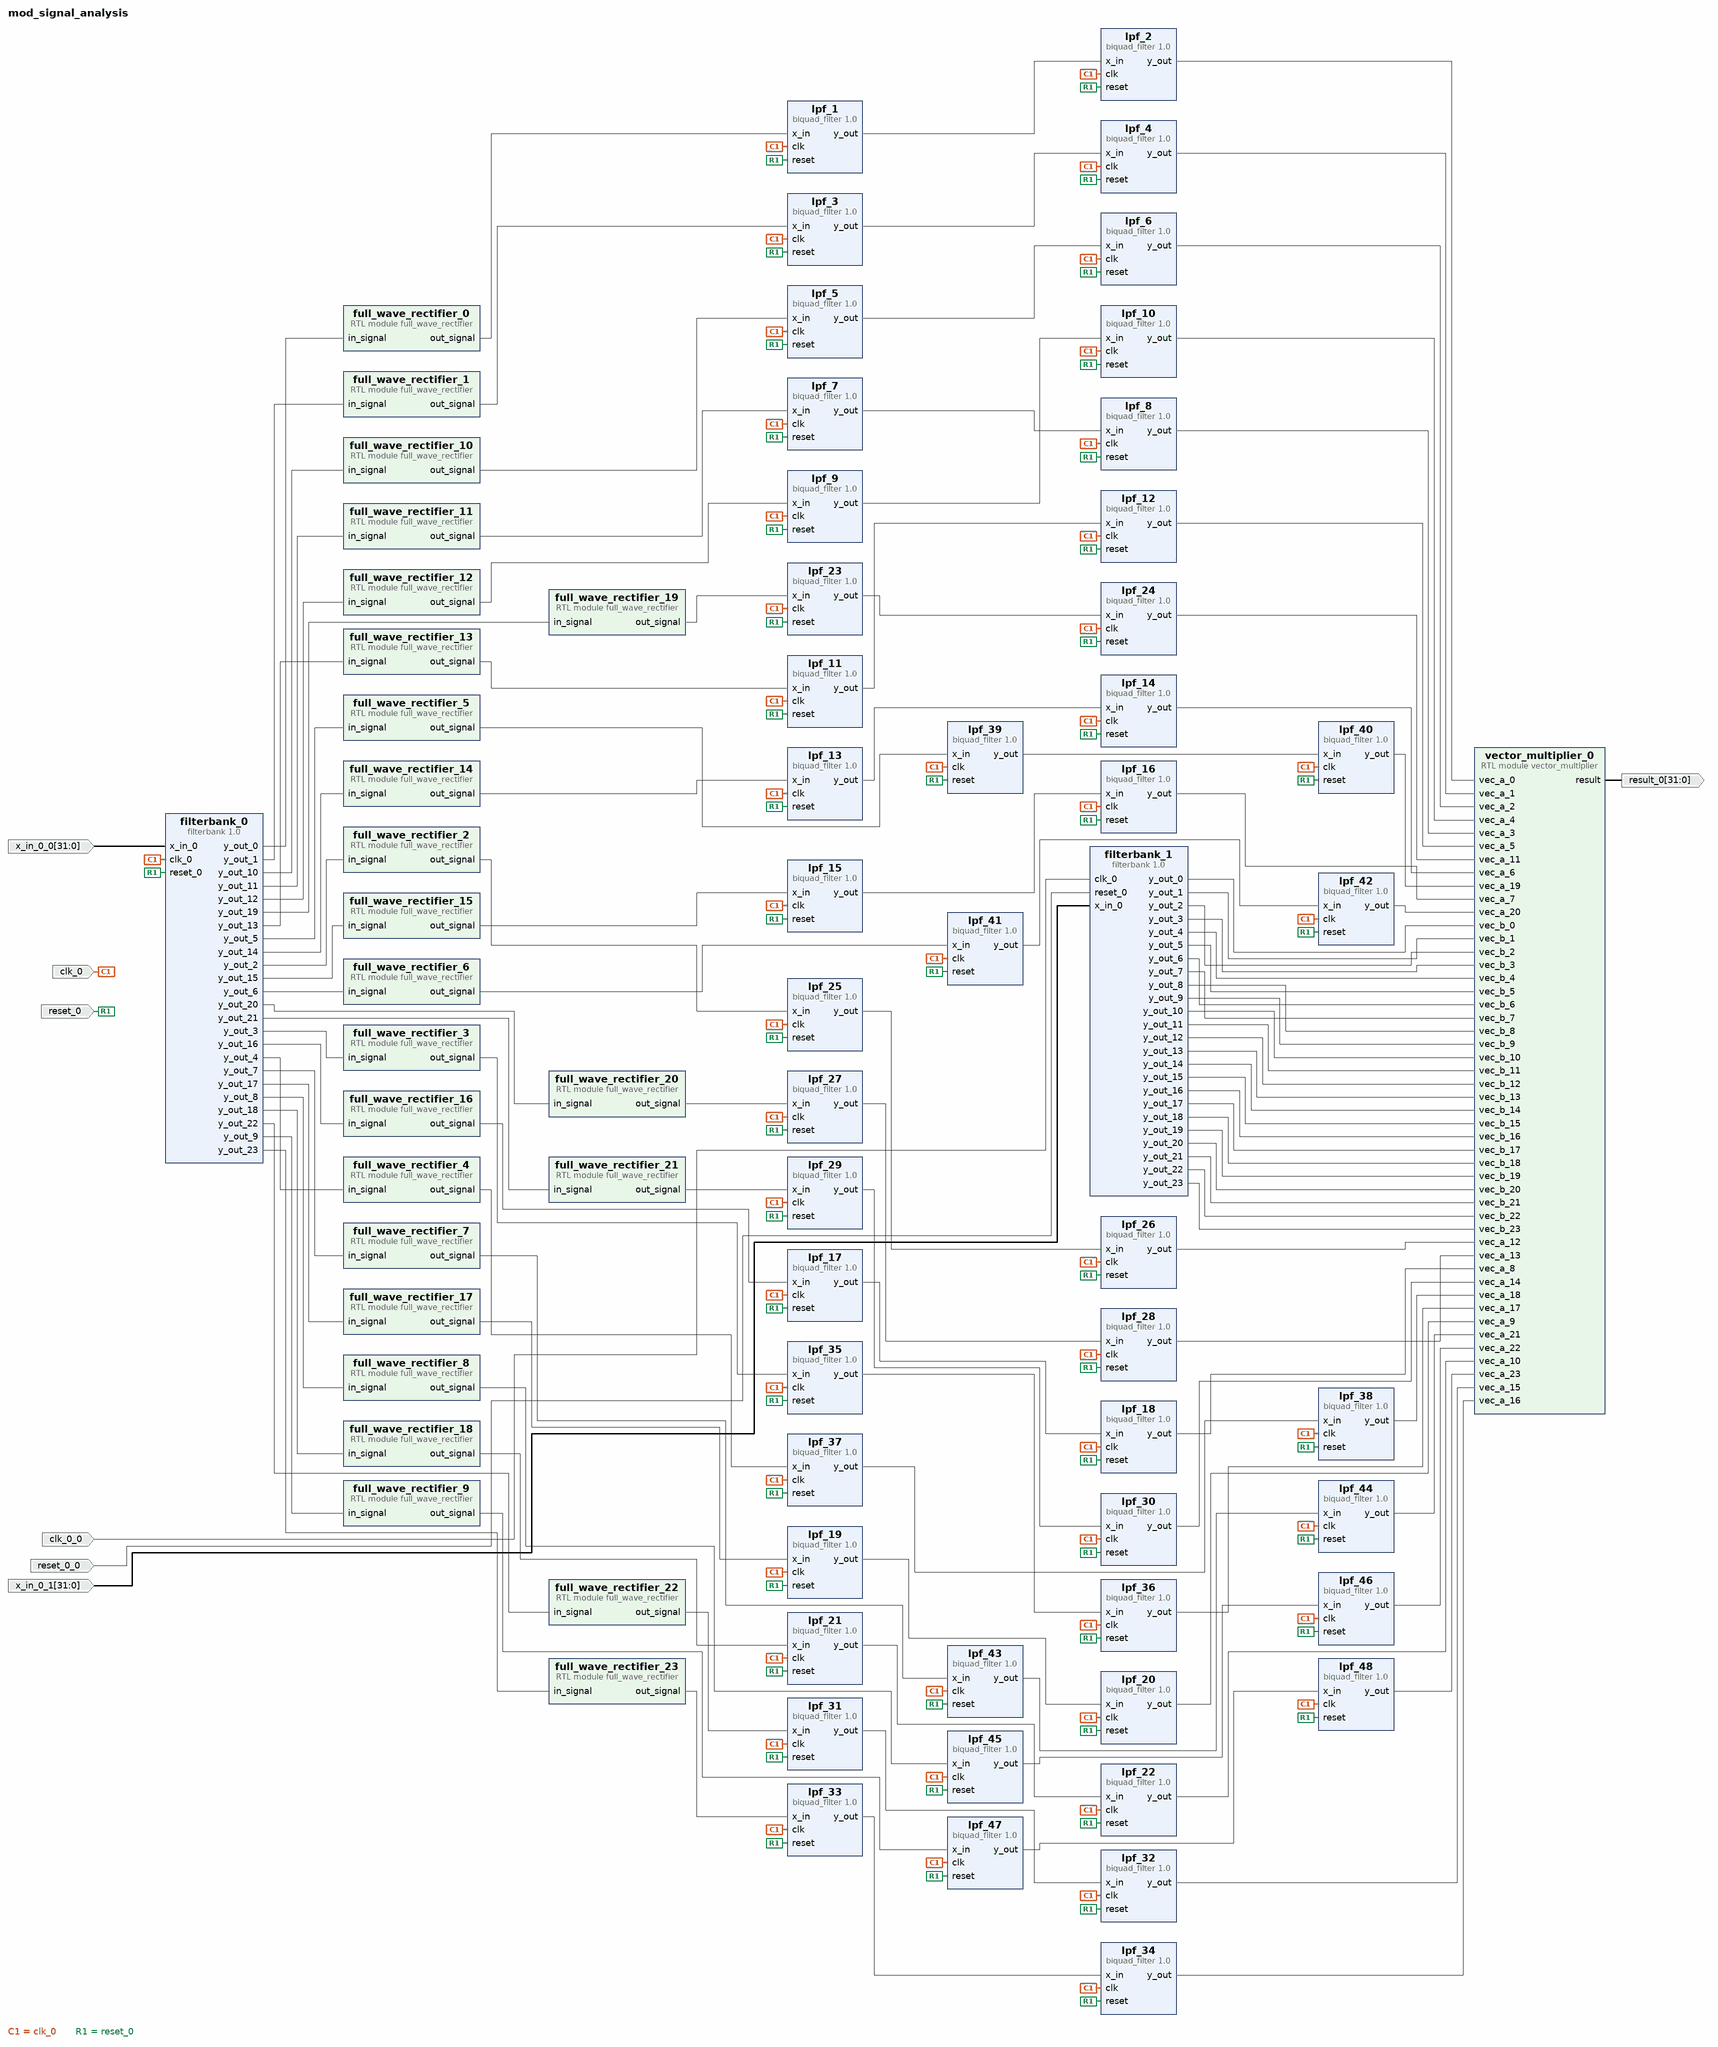
[diagram p0: block diagram of the top level]
# Vivado block design mod_signal_analysis, xc7a200tsbg484-1, Vivado 2023.2
create_bd_design mod_signal_analysis

create_bd_port -dir I -type clk clk_0
set_property -dict {CONFIG.CLK_DOMAIN filterbank_test_sim_clk_gen_1_0_clk CONFIG.FREQ_HZ 48000} [get_bd_ports clk_0]
create_bd_port -dir I -type rst reset_0
set_property -dict {CONFIG.POLARITY ACTIVE_HIGH} [get_bd_ports reset_0]
create_bd_port -dir I -from 31 -to 0 x_in_0_0
create_bd_port -dir I -type clk clk_0_0
set_property -dict {CONFIG.FREQ_HZ 48000} [get_bd_ports clk_0_0]
create_bd_port -dir I -type rst reset_0_0
set_property -dict {CONFIG.POLARITY ACTIVE_HIGH} [get_bd_ports reset_0_0]
create_bd_port -dir I -from 31 -to 0 x_in_0_1
create_bd_port -dir O -from 31 -to 0 result_0

create_bd_cell -type module -reference full_wave_rectifier full_wave_rectifier_0
create_bd_cell -type module -reference full_wave_rectifier full_wave_rectifier_1
create_bd_cell -type module -reference full_wave_rectifier full_wave_rectifier_2
create_bd_cell -type module -reference full_wave_rectifier full_wave_rectifier_3
create_bd_cell -type module -reference full_wave_rectifier full_wave_rectifier_4
create_bd_cell -type module -reference full_wave_rectifier full_wave_rectifier_5
create_bd_cell -type module -reference full_wave_rectifier full_wave_rectifier_6
create_bd_cell -type module -reference full_wave_rectifier full_wave_rectifier_7
create_bd_cell -type module -reference full_wave_rectifier full_wave_rectifier_8
create_bd_cell -type module -reference full_wave_rectifier full_wave_rectifier_9
create_bd_cell -type module -reference full_wave_rectifier full_wave_rectifier_10
create_bd_cell -type module -reference full_wave_rectifier full_wave_rectifier_11
create_bd_cell -type module -reference full_wave_rectifier full_wave_rectifier_12
create_bd_cell -type module -reference full_wave_rectifier full_wave_rectifier_13
create_bd_cell -type module -reference full_wave_rectifier full_wave_rectifier_14
create_bd_cell -type module -reference full_wave_rectifier full_wave_rectifier_15
create_bd_cell -type module -reference full_wave_rectifier full_wave_rectifier_16
create_bd_cell -type module -reference full_wave_rectifier full_wave_rectifier_17
create_bd_cell -type module -reference full_wave_rectifier full_wave_rectifier_18
create_bd_cell -type module -reference full_wave_rectifier full_wave_rectifier_19
create_bd_cell -type module -reference full_wave_rectifier full_wave_rectifier_20
create_bd_cell -type module -reference full_wave_rectifier full_wave_rectifier_21
create_bd_cell -type module -reference full_wave_rectifier full_wave_rectifier_22
create_bd_cell -type module -reference full_wave_rectifier full_wave_rectifier_23
create_bd_cell -type module -reference vector_multiplier vector_multiplier_0
create_bd_cell -type ip -vlnv xilinx.com:user:filterbank:1.0 filterbank_0
create_bd_cell -type ip -vlnv xilinx.com:user:filterbank:1.0 filterbank_1
create_bd_cell -type ip -vlnv xilinx.com:user:biquad_filter:1.0 lpf_1
set_property -dict {CONFIG.a1 0x80A6 CONFIG.a2 0x3F5D CONFIG.b0 0x0001 CONFIG.b1 0x0001 CONFIG.b2 0x0001} [get_bd_cells lpf_1]
create_bd_cell -type ip -vlnv xilinx.com:user:biquad_filter:1.0 lpf_2
set_property -dict {CONFIG.a1 0x818A CONFIG.a2 0x3E78 CONFIG.b0 0x0001 CONFIG.b1 0x0001 CONFIG.b2 0x0001} [get_bd_cells lpf_2]
create_bd_cell -type ip -vlnv xilinx.com:user:biquad_filter:1.0 lpf_19
set_property -dict {CONFIG.a1 0x80A6 CONFIG.a2 0x3F5D CONFIG.b0 0x0001 CONFIG.b1 0x0001 CONFIG.b2 0x0001} [get_bd_cells lpf_19]
create_bd_cell -type ip -vlnv xilinx.com:user:biquad_filter:1.0 lpf_21
set_property -dict {CONFIG.a1 0x80A6 CONFIG.a2 0x3F5D CONFIG.b0 0x0001 CONFIG.b1 0x0001 CONFIG.b2 0x0001} [get_bd_cells lpf_21]
create_bd_cell -type ip -vlnv xilinx.com:user:biquad_filter:1.0 lpf_23
set_property -dict {CONFIG.a1 0x80A6 CONFIG.a2 0x3F5D CONFIG.b0 0x0001 CONFIG.b1 0x0001 CONFIG.b2 0x0001} [get_bd_cells lpf_23]
create_bd_cell -type ip -vlnv xilinx.com:user:biquad_filter:1.0 lpf_25
set_property -dict {CONFIG.a1 0x80A6 CONFIG.a2 0x3F5D CONFIG.b0 0x0001 CONFIG.b1 0x0001 CONFIG.b2 0x0001} [get_bd_cells lpf_25]
create_bd_cell -type ip -vlnv xilinx.com:user:biquad_filter:1.0 lpf_27
set_property -dict {CONFIG.a1 0x80A6 CONFIG.a2 0x3F5D CONFIG.b0 0x0001 CONFIG.b1 0x0001 CONFIG.b2 0x0001} [get_bd_cells lpf_27]
create_bd_cell -type ip -vlnv xilinx.com:user:biquad_filter:1.0 lpf_29
set_property -dict {CONFIG.a1 0x80A6 CONFIG.a2 0x3F5D CONFIG.b0 0x0001 CONFIG.b1 0x0001 CONFIG.b2 0x0001} [get_bd_cells lpf_29]
create_bd_cell -type ip -vlnv xilinx.com:user:biquad_filter:1.0 lpf_31
set_property -dict {CONFIG.a1 0x80A6 CONFIG.a2 0x3F5D CONFIG.b0 0x0001 CONFIG.b1 0x0001 CONFIG.b2 0x0001} [get_bd_cells lpf_31]
create_bd_cell -type ip -vlnv xilinx.com:user:biquad_filter:1.0 lpf_33
set_property -dict {CONFIG.a1 0x80A6 CONFIG.a2 0x3F5D CONFIG.b0 0x0001 CONFIG.b1 0x0001 CONFIG.b2 0x0001} [get_bd_cells lpf_33]
create_bd_cell -type ip -vlnv xilinx.com:user:biquad_filter:1.0 lpf_35
set_property -dict {CONFIG.a1 0x80A6 CONFIG.a2 0x3F5D CONFIG.b0 0x0001 CONFIG.b1 0x0001 CONFIG.b2 0x0001} [get_bd_cells lpf_35]
create_bd_cell -type ip -vlnv xilinx.com:user:biquad_filter:1.0 lpf_37
set_property -dict {CONFIG.a1 0x80A6 CONFIG.a2 0x3F5D CONFIG.b0 0x0001 CONFIG.b1 0x0001 CONFIG.b2 0x0001} [get_bd_cells lpf_37]
create_bd_cell -type ip -vlnv xilinx.com:user:biquad_filter:1.0 lpf_3
set_property -dict {CONFIG.a1 0x80A6 CONFIG.a2 0x3F5D CONFIG.b0 0x0001 CONFIG.b1 0x0001 CONFIG.b2 0x0001} [get_bd_cells lpf_3]
create_bd_cell -type ip -vlnv xilinx.com:user:biquad_filter:1.0 lpf_39
set_property -dict {CONFIG.a1 0x80A6 CONFIG.a2 0x3F5D CONFIG.b0 0x0001 CONFIG.b1 0x0001 CONFIG.b2 0x0001} [get_bd_cells lpf_39]
create_bd_cell -type ip -vlnv xilinx.com:user:biquad_filter:1.0 lpf_41
set_property -dict {CONFIG.a1 0x80A6 CONFIG.a2 0x3F5D CONFIG.b0 0x0001 CONFIG.b1 0x0001 CONFIG.b2 0x0001} [get_bd_cells lpf_41]
create_bd_cell -type ip -vlnv xilinx.com:user:biquad_filter:1.0 lpf_43
set_property -dict {CONFIG.a1 0x80A6 CONFIG.a2 0x3F5D CONFIG.b0 0x0001 CONFIG.b1 0x0001 CONFIG.b2 0x0001} [get_bd_cells lpf_43]
create_bd_cell -type ip -vlnv xilinx.com:user:biquad_filter:1.0 lpf_45
set_property -dict {CONFIG.a1 0x80A6 CONFIG.a2 0x3F5D CONFIG.b0 0x0001 CONFIG.b1 0x0001 CONFIG.b2 0x0001} [get_bd_cells lpf_45]
create_bd_cell -type ip -vlnv xilinx.com:user:biquad_filter:1.0 lpf_47
set_property -dict {CONFIG.a1 0x80A6 CONFIG.a2 0x3F5D CONFIG.b0 0x0001 CONFIG.b1 0x0001 CONFIG.b2 0x0001} [get_bd_cells lpf_47]
create_bd_cell -type ip -vlnv xilinx.com:user:biquad_filter:1.0 lpf_5
set_property -dict {CONFIG.a1 0x80A6 CONFIG.a2 0x3F5D CONFIG.b0 0x0001 CONFIG.b1 0x0001 CONFIG.b2 0x0001} [get_bd_cells lpf_5]
create_bd_cell -type ip -vlnv xilinx.com:user:biquad_filter:1.0 lpf_7
set_property -dict {CONFIG.a1 0x80A6 CONFIG.a2 0x3F5D CONFIG.b0 0x0001 CONFIG.b1 0x0001 CONFIG.b2 0x0001} [get_bd_cells lpf_7]
create_bd_cell -type ip -vlnv xilinx.com:user:biquad_filter:1.0 lpf_9
set_property -dict {CONFIG.a1 0x80A6 CONFIG.a2 0x3F5D CONFIG.b0 0x0001 CONFIG.b1 0x0001 CONFIG.b2 0x0001} [get_bd_cells lpf_9]
create_bd_cell -type ip -vlnv xilinx.com:user:biquad_filter:1.0 lpf_11
set_property -dict {CONFIG.a1 0x80A6 CONFIG.a2 0x3F5D CONFIG.b0 0x0001 CONFIG.b1 0x0001 CONFIG.b2 0x0001} [get_bd_cells lpf_11]
create_bd_cell -type ip -vlnv xilinx.com:user:biquad_filter:1.0 lpf_13
set_property -dict {CONFIG.a1 0x80A6 CONFIG.a2 0x3F5D CONFIG.b0 0x0001 CONFIG.b1 0x0001 CONFIG.b2 0x0001} [get_bd_cells lpf_13]
create_bd_cell -type ip -vlnv xilinx.com:user:biquad_filter:1.0 lpf_15
set_property -dict {CONFIG.a1 0x80A6 CONFIG.a2 0x3F5D CONFIG.b0 0x0001 CONFIG.b1 0x0001 CONFIG.b2 0x0001} [get_bd_cells lpf_15]
create_bd_cell -type ip -vlnv xilinx.com:user:biquad_filter:1.0 lpf_17
set_property -dict {CONFIG.a1 0x80A6 CONFIG.a2 0x3F5D CONFIG.b0 0x0001 CONFIG.b1 0x0001 CONFIG.b2 0x0001} [get_bd_cells lpf_17]
create_bd_cell -type ip -vlnv xilinx.com:user:biquad_filter:1.0 lpf_4
set_property -dict {CONFIG.a1 0x818A CONFIG.a2 0x3E78 CONFIG.b0 0x0001 CONFIG.b1 0x0001 CONFIG.b2 0x0001} [get_bd_cells lpf_4]
create_bd_cell -type ip -vlnv xilinx.com:user:biquad_filter:1.0 lpf_22
set_property -dict {CONFIG.a1 0x818A CONFIG.a2 0x3E78 CONFIG.b0 0x0001 CONFIG.b1 0x0001 CONFIG.b2 0x0001} [get_bd_cells lpf_22]
create_bd_cell -type ip -vlnv xilinx.com:user:biquad_filter:1.0 lpf_24
set_property -dict {CONFIG.a1 0x818A CONFIG.a2 0x3E78 CONFIG.b0 0x0001 CONFIG.b1 0x0001 CONFIG.b2 0x0001} [get_bd_cells lpf_24]
create_bd_cell -type ip -vlnv xilinx.com:user:biquad_filter:1.0 lpf_26
set_property -dict {CONFIG.a1 0x818A CONFIG.a2 0x3E78 CONFIG.b0 0x0001 CONFIG.b1 0x0001 CONFIG.b2 0x0001} [get_bd_cells lpf_26]
create_bd_cell -type ip -vlnv xilinx.com:user:biquad_filter:1.0 lpf_28
set_property -dict {CONFIG.a1 0x818A CONFIG.a2 0x3E78 CONFIG.b0 0x0001 CONFIG.b1 0x0001 CONFIG.b2 0x0001} [get_bd_cells lpf_28]
create_bd_cell -type ip -vlnv xilinx.com:user:biquad_filter:1.0 lpf_30
set_property -dict {CONFIG.a1 0x818A CONFIG.a2 0x3E78 CONFIG.b0 0x0001 CONFIG.b1 0x0001 CONFIG.b2 0x0001} [get_bd_cells lpf_30]
create_bd_cell -type ip -vlnv xilinx.com:user:biquad_filter:1.0 lpf_32
set_property -dict {CONFIG.a1 0x818A CONFIG.a2 0x3E78 CONFIG.b0 0x0001 CONFIG.b1 0x0001 CONFIG.b2 0x0001} [get_bd_cells lpf_32]
create_bd_cell -type ip -vlnv xilinx.com:user:biquad_filter:1.0 lpf_34
set_property -dict {CONFIG.a1 0x818A CONFIG.a2 0x3E78 CONFIG.b0 0x0001 CONFIG.b1 0x0001 CONFIG.b2 0x0001} [get_bd_cells lpf_34]
create_bd_cell -type ip -vlnv xilinx.com:user:biquad_filter:1.0 lpf_36
set_property -dict {CONFIG.a1 0x818A CONFIG.a2 0x3E78 CONFIG.b0 0x0001 CONFIG.b1 0x0001 CONFIG.b2 0x0001} [get_bd_cells lpf_36]
create_bd_cell -type ip -vlnv xilinx.com:user:biquad_filter:1.0 lpf_38
set_property -dict {CONFIG.a1 0x818A CONFIG.a2 0x3E78 CONFIG.b0 0x0001 CONFIG.b1 0x0001 CONFIG.b2 0x0001} [get_bd_cells lpf_38]
create_bd_cell -type ip -vlnv xilinx.com:user:biquad_filter:1.0 lpf_40
set_property -dict {CONFIG.a1 0x818A CONFIG.a2 0x3E78 CONFIG.b0 0x0001 CONFIG.b1 0x0001 CONFIG.b2 0x0001} [get_bd_cells lpf_40]
create_bd_cell -type ip -vlnv xilinx.com:user:biquad_filter:1.0 lpf_6
set_property -dict {CONFIG.a1 0x818A CONFIG.a2 0x3E78 CONFIG.b0 0x0001 CONFIG.b1 0x0001 CONFIG.b2 0x0001} [get_bd_cells lpf_6]
create_bd_cell -type ip -vlnv xilinx.com:user:biquad_filter:1.0 lpf_42
set_property -dict {CONFIG.a1 0x818A CONFIG.a2 0x3E78 CONFIG.b0 0x0001 CONFIG.b1 0x0001 CONFIG.b2 0x0001} [get_bd_cells lpf_42]
create_bd_cell -type ip -vlnv xilinx.com:user:biquad_filter:1.0 lpf_44
set_property -dict {CONFIG.a1 0x818A CONFIG.a2 0x3E78 CONFIG.b0 0x0001 CONFIG.b1 0x0001 CONFIG.b2 0x0001} [get_bd_cells lpf_44]
create_bd_cell -type ip -vlnv xilinx.com:user:biquad_filter:1.0 lpf_46
set_property -dict {CONFIG.a1 0x818A CONFIG.a2 0x3E78 CONFIG.b0 0x0001 CONFIG.b1 0x0001 CONFIG.b2 0x0001} [get_bd_cells lpf_46]
create_bd_cell -type ip -vlnv xilinx.com:user:biquad_filter:1.0 lpf_48
set_property -dict {CONFIG.a1 0x818A CONFIG.a2 0x3E78 CONFIG.b0 0x0001 CONFIG.b1 0x0001 CONFIG.b2 0x0001} [get_bd_cells lpf_48]
create_bd_cell -type ip -vlnv xilinx.com:user:biquad_filter:1.0 lpf_8
set_property -dict {CONFIG.a1 0x818A CONFIG.a2 0x3E78 CONFIG.b0 0x0001 CONFIG.b1 0x0001 CONFIG.b2 0x0001} [get_bd_cells lpf_8]
create_bd_cell -type ip -vlnv xilinx.com:user:biquad_filter:1.0 lpf_10
set_property -dict {CONFIG.a1 0x818A CONFIG.a2 0x3E78 CONFIG.b0 0x0001 CONFIG.b1 0x0001 CONFIG.b2 0x0001} [get_bd_cells lpf_10]
create_bd_cell -type ip -vlnv xilinx.com:user:biquad_filter:1.0 lpf_12
set_property -dict {CONFIG.a1 0x818A CONFIG.a2 0x3E78 CONFIG.b0 0x0001 CONFIG.b1 0x0001 CONFIG.b2 0x0001} [get_bd_cells lpf_12]
create_bd_cell -type ip -vlnv xilinx.com:user:biquad_filter:1.0 lpf_14
set_property -dict {CONFIG.a1 0x818A CONFIG.a2 0x3E78 CONFIG.b0 0x0001 CONFIG.b1 0x0001 CONFIG.b2 0x0001} [get_bd_cells lpf_14]
create_bd_cell -type ip -vlnv xilinx.com:user:biquad_filter:1.0 lpf_16
set_property -dict {CONFIG.a1 0x818A CONFIG.a2 0x3E78 CONFIG.b0 0x0001 CONFIG.b1 0x0001 CONFIG.b2 0x0001} [get_bd_cells lpf_16]
create_bd_cell -type ip -vlnv xilinx.com:user:biquad_filter:1.0 lpf_18
set_property -dict {CONFIG.a1 0x818A CONFIG.a2 0x3E78 CONFIG.b0 0x0001 CONFIG.b1 0x0001 CONFIG.b2 0x0001} [get_bd_cells lpf_18]
create_bd_cell -type ip -vlnv xilinx.com:user:biquad_filter:1.0 lpf_20
set_property -dict {CONFIG.a1 0x818A CONFIG.a2 0x3E78 CONFIG.b0 0x0001 CONFIG.b1 0x0001 CONFIG.b2 0x0001} [get_bd_cells lpf_20]

# ---- connections ----

connect_bd_net -net clk_0_0_1 [get_bd_ports clk_0_0] [get_bd_pins filterbank_1/clk_0]
connect_bd_net [get_bd_pins filterbank_0/y_out_0] [get_bd_pins full_wave_rectifier_0/in_signal]
connect_bd_net [get_bd_pins filterbank_0/y_out_1] [get_bd_pins full_wave_rectifier_1/in_signal]
connect_bd_net [get_bd_pins filterbank_0/y_out_2] [get_bd_pins full_wave_rectifier_2/in_signal]
connect_bd_net [get_bd_pins filterbank_0/y_out_3] [get_bd_pins full_wave_rectifier_3/in_signal]
connect_bd_net [get_bd_pins filterbank_0/y_out_4] [get_bd_pins full_wave_rectifier_4/in_signal]
connect_bd_net [get_bd_pins filterbank_0/y_out_5] [get_bd_pins full_wave_rectifier_5/in_signal]
connect_bd_net [get_bd_pins filterbank_0/y_out_6] [get_bd_pins full_wave_rectifier_6/in_signal]
connect_bd_net [get_bd_pins filterbank_0/y_out_7] [get_bd_pins full_wave_rectifier_7/in_signal]
connect_bd_net [get_bd_pins filterbank_0/y_out_8] [get_bd_pins full_wave_rectifier_8/in_signal]
connect_bd_net [get_bd_pins filterbank_0/y_out_9] [get_bd_pins full_wave_rectifier_9/in_signal]
connect_bd_net [get_bd_pins filterbank_0/y_out_10] [get_bd_pins full_wave_rectifier_10/in_signal]
connect_bd_net [get_bd_pins filterbank_0/y_out_11] [get_bd_pins full_wave_rectifier_11/in_signal]
connect_bd_net [get_bd_pins filterbank_0/y_out_12] [get_bd_pins full_wave_rectifier_12/in_signal]
connect_bd_net [get_bd_pins filterbank_0/y_out_13] [get_bd_pins full_wave_rectifier_13/in_signal]
connect_bd_net [get_bd_pins filterbank_0/y_out_14] [get_bd_pins full_wave_rectifier_14/in_signal]
connect_bd_net [get_bd_pins filterbank_0/y_out_15] [get_bd_pins full_wave_rectifier_15/in_signal]
connect_bd_net [get_bd_pins filterbank_0/y_out_16] [get_bd_pins full_wave_rectifier_16/in_signal]
connect_bd_net [get_bd_pins filterbank_0/y_out_17] [get_bd_pins full_wave_rectifier_17/in_signal]
connect_bd_net [get_bd_pins filterbank_0/y_out_18] [get_bd_pins full_wave_rectifier_18/in_signal]
connect_bd_net [get_bd_pins filterbank_0/y_out_19] [get_bd_pins full_wave_rectifier_19/in_signal]
connect_bd_net [get_bd_pins filterbank_0/y_out_20] [get_bd_pins full_wave_rectifier_20/in_signal]
connect_bd_net [get_bd_pins filterbank_0/y_out_21] [get_bd_pins full_wave_rectifier_21/in_signal]
connect_bd_net [get_bd_pins filterbank_0/y_out_22] [get_bd_pins full_wave_rectifier_22/in_signal]
connect_bd_net [get_bd_pins filterbank_0/y_out_23] [get_bd_pins full_wave_rectifier_23/in_signal]
connect_bd_net [get_bd_pins filterbank_1/y_out_0] [get_bd_pins vector_multiplier_0/vec_b_0]
connect_bd_net [get_bd_pins filterbank_1/y_out_1] [get_bd_pins vector_multiplier_0/vec_b_1]
connect_bd_net [get_bd_pins filterbank_1/y_out_2] [get_bd_pins vector_multiplier_0/vec_b_2]
connect_bd_net [get_bd_pins filterbank_1/y_out_3] [get_bd_pins vector_multiplier_0/vec_b_3]
connect_bd_net [get_bd_pins filterbank_1/y_out_4] [get_bd_pins vector_multiplier_0/vec_b_4]
connect_bd_net [get_bd_pins filterbank_1/y_out_5] [get_bd_pins vector_multiplier_0/vec_b_5]
connect_bd_net [get_bd_pins filterbank_1/y_out_6] [get_bd_pins vector_multiplier_0/vec_b_6]
connect_bd_net [get_bd_pins filterbank_1/y_out_7] [get_bd_pins vector_multiplier_0/vec_b_7]
connect_bd_net [get_bd_pins filterbank_1/y_out_8] [get_bd_pins vector_multiplier_0/vec_b_8]
connect_bd_net [get_bd_pins filterbank_1/y_out_9] [get_bd_pins vector_multiplier_0/vec_b_9]
connect_bd_net [get_bd_pins filterbank_1/y_out_10] [get_bd_pins vector_multiplier_0/vec_b_10]
connect_bd_net [get_bd_pins filterbank_1/y_out_11] [get_bd_pins vector_multiplier_0/vec_b_11]
connect_bd_net [get_bd_pins filterbank_1/y_out_12] [get_bd_pins vector_multiplier_0/vec_b_12]
connect_bd_net [get_bd_pins filterbank_1/y_out_13] [get_bd_pins vector_multiplier_0/vec_b_13]
connect_bd_net [get_bd_pins filterbank_1/y_out_14] [get_bd_pins vector_multiplier_0/vec_b_14]
connect_bd_net [get_bd_pins filterbank_1/y_out_15] [get_bd_pins vector_multiplier_0/vec_b_15]
connect_bd_net [get_bd_pins filterbank_1/y_out_16] [get_bd_pins vector_multiplier_0/vec_b_16]
connect_bd_net [get_bd_pins filterbank_1/y_out_17] [get_bd_pins vector_multiplier_0/vec_b_17]
connect_bd_net [get_bd_pins filterbank_1/y_out_18] [get_bd_pins vector_multiplier_0/vec_b_18]
connect_bd_net [get_bd_pins filterbank_1/y_out_19] [get_bd_pins vector_multiplier_0/vec_b_19]
connect_bd_net [get_bd_pins filterbank_1/y_out_20] [get_bd_pins vector_multiplier_0/vec_b_20]
connect_bd_net [get_bd_pins filterbank_1/y_out_21] [get_bd_pins vector_multiplier_0/vec_b_21]
connect_bd_net [get_bd_pins filterbank_1/y_out_22] [get_bd_pins vector_multiplier_0/vec_b_22]
connect_bd_net [get_bd_pins filterbank_1/y_out_23] [get_bd_pins vector_multiplier_0/vec_b_23]
connect_bd_net [get_bd_pins full_wave_rectifier_0/out_signal] [get_bd_pins lpf_1/x_in]
connect_bd_net -net full_wave_rectifier_0_out_signal1 [get_bd_pins full_wave_rectifier_1/out_signal] [get_bd_pins lpf_3/x_in]
connect_bd_net -net full_wave_rectifier_0_out_signal2 [get_bd_pins full_wave_rectifier_10/out_signal] [get_bd_pins lpf_5/x_in]
connect_bd_net -net full_wave_rectifier_0_out_signal3 [get_bd_pins full_wave_rectifier_11/out_signal] [get_bd_pins lpf_7/x_in]
connect_bd_net -net full_wave_rectifier_0_out_signal4 [get_bd_pins full_wave_rectifier_12/out_signal] [get_bd_pins lpf_9/x_in]
connect_bd_net -net full_wave_rectifier_0_out_signal5 [get_bd_pins full_wave_rectifier_13/out_signal] [get_bd_pins lpf_11/x_in]
connect_bd_net -net full_wave_rectifier_0_out_signal6 [get_bd_pins full_wave_rectifier_14/out_signal] [get_bd_pins lpf_13/x_in]
connect_bd_net -net full_wave_rectifier_0_out_signal7 [get_bd_pins full_wave_rectifier_15/out_signal] [get_bd_pins lpf_15/x_in]
connect_bd_net -net full_wave_rectifier_0_out_signal8 [get_bd_pins full_wave_rectifier_16/out_signal] [get_bd_pins lpf_17/x_in]
connect_bd_net -net full_wave_rectifier_0_out_signal9 [get_bd_pins full_wave_rectifier_17/out_signal] [get_bd_pins lpf_19/x_in]
connect_bd_net -net full_wave_rectifier_0_out_signal10 [get_bd_pins full_wave_rectifier_18/out_signal] [get_bd_pins lpf_21/x_in]
connect_bd_net -net full_wave_rectifier_0_out_signal11 [get_bd_pins full_wave_rectifier_19/out_signal] [get_bd_pins lpf_23/x_in]
connect_bd_net -net full_wave_rectifier_0_out_signal12 [get_bd_pins full_wave_rectifier_2/out_signal] [get_bd_pins lpf_25/x_in]
connect_bd_net -net full_wave_rectifier_0_out_signal13 [get_bd_pins full_wave_rectifier_20/out_signal] [get_bd_pins lpf_27/x_in]
connect_bd_net -net full_wave_rectifier_0_out_signal14 [get_bd_pins full_wave_rectifier_21/out_signal] [get_bd_pins lpf_29/x_in]
connect_bd_net -net full_wave_rectifier_0_out_signal15 [get_bd_pins full_wave_rectifier_22/out_signal] [get_bd_pins lpf_31/x_in]
connect_bd_net -net full_wave_rectifier_0_out_signal16 [get_bd_pins full_wave_rectifier_23/out_signal] [get_bd_pins lpf_33/x_in]
connect_bd_net -net full_wave_rectifier_0_out_signal17 [get_bd_pins full_wave_rectifier_3/out_signal] [get_bd_pins lpf_35/x_in]
connect_bd_net -net full_wave_rectifier_0_out_signal18 [get_bd_pins full_wave_rectifier_4/out_signal] [get_bd_pins lpf_37/x_in]
connect_bd_net -net full_wave_rectifier_0_out_signal19 [get_bd_pins full_wave_rectifier_5/out_signal] [get_bd_pins lpf_39/x_in]
connect_bd_net -net full_wave_rectifier_0_out_signal20 [get_bd_pins full_wave_rectifier_6/out_signal] [get_bd_pins lpf_41/x_in]
connect_bd_net -net full_wave_rectifier_0_out_signal21 [get_bd_pins full_wave_rectifier_7/out_signal] [get_bd_pins lpf_43/x_in]
connect_bd_net -net full_wave_rectifier_0_out_signal22 [get_bd_pins full_wave_rectifier_8/out_signal] [get_bd_pins lpf_45/x_in]
connect_bd_net -net full_wave_rectifier_0_out_signal23 [get_bd_pins full_wave_rectifier_9/out_signal] [get_bd_pins lpf_47/x_in]
connect_bd_net [get_bd_pins lpf_10/y_out] [get_bd_pins vector_multiplier_0/vec_a_4]
connect_bd_net [get_bd_pins lpf_12/y_out] [get_bd_pins vector_multiplier_0/vec_a_5]
connect_bd_net [get_bd_pins lpf_14/y_out] [get_bd_pins vector_multiplier_0/vec_a_6]
connect_bd_net [get_bd_pins lpf_16/y_out] [get_bd_pins vector_multiplier_0/vec_a_7]
connect_bd_net [get_bd_pins lpf_18/y_out] [get_bd_pins vector_multiplier_0/vec_a_8]
connect_bd_net [get_bd_pins lpf_1/y_out] [get_bd_pins lpf_2/x_in]
connect_bd_net -net lpf_1_y_out1 [get_bd_pins lpf_3/y_out] [get_bd_pins lpf_4/x_in]
connect_bd_net -net lpf_1_y_out2 [get_bd_pins lpf_5/y_out] [get_bd_pins lpf_6/x_in]
connect_bd_net -net lpf_1_y_out3 [get_bd_pins lpf_7/y_out] [get_bd_pins lpf_8/x_in]
connect_bd_net -net lpf_1_y_out4 [get_bd_pins lpf_9/y_out] [get_bd_pins lpf_10/x_in]
connect_bd_net -net lpf_1_y_out5 [get_bd_pins lpf_11/y_out] [get_bd_pins lpf_12/x_in]
connect_bd_net -net lpf_1_y_out6 [get_bd_pins lpf_13/y_out] [get_bd_pins lpf_14/x_in]
connect_bd_net -net lpf_1_y_out7 [get_bd_pins lpf_15/y_out] [get_bd_pins lpf_16/x_in]
connect_bd_net -net lpf_1_y_out8 [get_bd_pins lpf_17/y_out] [get_bd_pins lpf_18/x_in]
connect_bd_net -net lpf_1_y_out9 [get_bd_pins lpf_19/y_out] [get_bd_pins lpf_20/x_in]
connect_bd_net -net lpf_1_y_out10 [get_bd_pins lpf_21/y_out] [get_bd_pins lpf_22/x_in]
connect_bd_net -net lpf_1_y_out11 [get_bd_pins lpf_23/y_out] [get_bd_pins lpf_24/x_in]
connect_bd_net -net lpf_1_y_out12 [get_bd_pins lpf_25/y_out] [get_bd_pins lpf_26/x_in]
connect_bd_net -net lpf_1_y_out13 [get_bd_pins lpf_27/y_out] [get_bd_pins lpf_28/x_in]
connect_bd_net -net lpf_1_y_out14 [get_bd_pins lpf_29/y_out] [get_bd_pins lpf_30/x_in]
connect_bd_net -net lpf_1_y_out15 [get_bd_pins lpf_31/y_out] [get_bd_pins lpf_32/x_in]
connect_bd_net -net lpf_1_y_out16 [get_bd_pins lpf_33/y_out] [get_bd_pins lpf_34/x_in]
connect_bd_net -net lpf_1_y_out17 [get_bd_pins lpf_35/y_out] [get_bd_pins lpf_36/x_in]
connect_bd_net -net lpf_1_y_out18 [get_bd_pins lpf_37/y_out] [get_bd_pins lpf_38/x_in]
connect_bd_net -net lpf_1_y_out19 [get_bd_pins lpf_39/y_out] [get_bd_pins lpf_40/x_in]
connect_bd_net -net lpf_1_y_out20 [get_bd_pins lpf_41/y_out] [get_bd_pins lpf_42/x_in]
connect_bd_net -net lpf_1_y_out21 [get_bd_pins lpf_43/y_out] [get_bd_pins lpf_44/x_in]
connect_bd_net -net lpf_1_y_out22 [get_bd_pins lpf_45/y_out] [get_bd_pins lpf_46/x_in]
connect_bd_net -net lpf_1_y_out23 [get_bd_pins lpf_47/y_out] [get_bd_pins lpf_48/x_in]
connect_bd_net [get_bd_pins lpf_20/y_out] [get_bd_pins vector_multiplier_0/vec_a_9]
connect_bd_net [get_bd_pins lpf_22/y_out] [get_bd_pins vector_multiplier_0/vec_a_10]
connect_bd_net [get_bd_pins lpf_24/y_out] [get_bd_pins vector_multiplier_0/vec_a_11]
connect_bd_net [get_bd_pins lpf_26/y_out] [get_bd_pins vector_multiplier_0/vec_a_12]
connect_bd_net [get_bd_pins lpf_28/y_out] [get_bd_pins vector_multiplier_0/vec_a_13]
connect_bd_net [get_bd_pins lpf_2/y_out] [get_bd_pins vector_multiplier_0/vec_a_0]
connect_bd_net [get_bd_pins lpf_30/y_out] [get_bd_pins vector_multiplier_0/vec_a_14]
connect_bd_net [get_bd_pins lpf_32/y_out] [get_bd_pins vector_multiplier_0/vec_a_15]
connect_bd_net [get_bd_pins lpf_34/y_out] [get_bd_pins vector_multiplier_0/vec_a_16]
connect_bd_net [get_bd_pins lpf_36/y_out] [get_bd_pins vector_multiplier_0/vec_a_17]
connect_bd_net [get_bd_pins lpf_38/y_out] [get_bd_pins vector_multiplier_0/vec_a_18]
connect_bd_net [get_bd_pins lpf_40/y_out] [get_bd_pins vector_multiplier_0/vec_a_19]
connect_bd_net [get_bd_pins lpf_42/y_out] [get_bd_pins vector_multiplier_0/vec_a_20]
connect_bd_net [get_bd_pins lpf_44/y_out] [get_bd_pins vector_multiplier_0/vec_a_21]
connect_bd_net [get_bd_pins lpf_46/y_out] [get_bd_pins vector_multiplier_0/vec_a_22]
connect_bd_net [get_bd_pins lpf_48/y_out] [get_bd_pins vector_multiplier_0/vec_a_23]
connect_bd_net [get_bd_pins lpf_4/y_out] [get_bd_pins vector_multiplier_0/vec_a_1]
connect_bd_net [get_bd_pins lpf_6/y_out] [get_bd_pins vector_multiplier_0/vec_a_2]
connect_bd_net [get_bd_pins lpf_8/y_out] [get_bd_pins vector_multiplier_0/vec_a_3]
connect_bd_net -net reset_0_0_1 [get_bd_ports reset_0_0] [get_bd_pins filterbank_1/reset_0]
connect_bd_net -net sim_clk_gen_1_clk [get_bd_ports clk_0] \
  [get_bd_pins lpf_1/clk] [get_bd_pins filterbank_0/clk_0] [get_bd_pins lpf_2/clk] [get_bd_pins lpf_19/clk] \
  [get_bd_pins lpf_21/clk] [get_bd_pins lpf_23/clk] [get_bd_pins lpf_25/clk] [get_bd_pins lpf_27/clk] \
  [get_bd_pins lpf_29/clk] [get_bd_pins lpf_31/clk] [get_bd_pins lpf_33/clk] [get_bd_pins lpf_35/clk] \
  [get_bd_pins lpf_37/clk] [get_bd_pins lpf_3/clk] [get_bd_pins lpf_39/clk] [get_bd_pins lpf_41/clk] [get_bd_pins lpf_43/clk] \
  [get_bd_pins lpf_45/clk] [get_bd_pins lpf_47/clk] [get_bd_pins lpf_5/clk] [get_bd_pins lpf_7/clk] [get_bd_pins lpf_9/clk] \
  [get_bd_pins lpf_11/clk] [get_bd_pins lpf_13/clk] [get_bd_pins lpf_15/clk] [get_bd_pins lpf_17/clk] [get_bd_pins lpf_4/clk] \
  [get_bd_pins lpf_22/clk] [get_bd_pins lpf_24/clk] [get_bd_pins lpf_26/clk] [get_bd_pins lpf_28/clk] \
  [get_bd_pins lpf_30/clk] [get_bd_pins lpf_32/clk] [get_bd_pins lpf_34/clk] [get_bd_pins lpf_36/clk] \
  [get_bd_pins lpf_38/clk] [get_bd_pins lpf_40/clk] [get_bd_pins lpf_6/clk] [get_bd_pins lpf_42/clk] [get_bd_pins lpf_44/clk] \
  [get_bd_pins lpf_46/clk] [get_bd_pins lpf_48/clk] [get_bd_pins lpf_8/clk] [get_bd_pins lpf_10/clk] [get_bd_pins lpf_12/clk] \
  [get_bd_pins lpf_14/clk] [get_bd_pins lpf_16/clk] [get_bd_pins lpf_18/clk] [get_bd_pins lpf_20/clk]
connect_bd_net -net sim_clk_gen_1_sync_rst [get_bd_ports reset_0] \
  [get_bd_pins lpf_1/reset] [get_bd_pins filterbank_0/reset_0] [get_bd_pins lpf_2/reset] [get_bd_pins lpf_19/reset] \
  [get_bd_pins lpf_21/reset] [get_bd_pins lpf_23/reset] [get_bd_pins lpf_25/reset] [get_bd_pins lpf_27/reset] \
  [get_bd_pins lpf_29/reset] [get_bd_pins lpf_31/reset] [get_bd_pins lpf_33/reset] [get_bd_pins lpf_35/reset] \
  [get_bd_pins lpf_37/reset] [get_bd_pins lpf_3/reset] [get_bd_pins lpf_39/reset] [get_bd_pins lpf_41/reset] \
  [get_bd_pins lpf_43/reset] [get_bd_pins lpf_45/reset] [get_bd_pins lpf_47/reset] [get_bd_pins lpf_5/reset] \
  [get_bd_pins lpf_7/reset] [get_bd_pins lpf_9/reset] [get_bd_pins lpf_11/reset] [get_bd_pins lpf_13/reset] \
  [get_bd_pins lpf_15/reset] [get_bd_pins lpf_17/reset] [get_bd_pins lpf_4/reset] [get_bd_pins lpf_22/reset] \
  [get_bd_pins lpf_24/reset] [get_bd_pins lpf_26/reset] [get_bd_pins lpf_28/reset] [get_bd_pins lpf_30/reset] \
  [get_bd_pins lpf_32/reset] [get_bd_pins lpf_34/reset] [get_bd_pins lpf_36/reset] [get_bd_pins lpf_38/reset] \
  [get_bd_pins lpf_40/reset] [get_bd_pins lpf_6/reset] [get_bd_pins lpf_42/reset] [get_bd_pins lpf_44/reset] \
  [get_bd_pins lpf_46/reset] [get_bd_pins lpf_48/reset] [get_bd_pins lpf_8/reset] [get_bd_pins lpf_10/reset] \
  [get_bd_pins lpf_12/reset] [get_bd_pins lpf_14/reset] [get_bd_pins lpf_16/reset] [get_bd_pins lpf_18/reset] \
  [get_bd_pins lpf_20/reset]
connect_bd_net [get_bd_pins vector_multiplier_0/result] [get_bd_ports result_0]
connect_bd_net -net x_in_0_0_1 [get_bd_ports x_in_0_0] [get_bd_pins filterbank_0/x_in_0]
connect_bd_net -net x_in_0_1_1 [get_bd_ports x_in_0_1] [get_bd_pins filterbank_1/x_in_0]

validate_bd_design
save_bd_design
